# Altium project Demo_v1.PrjPcb
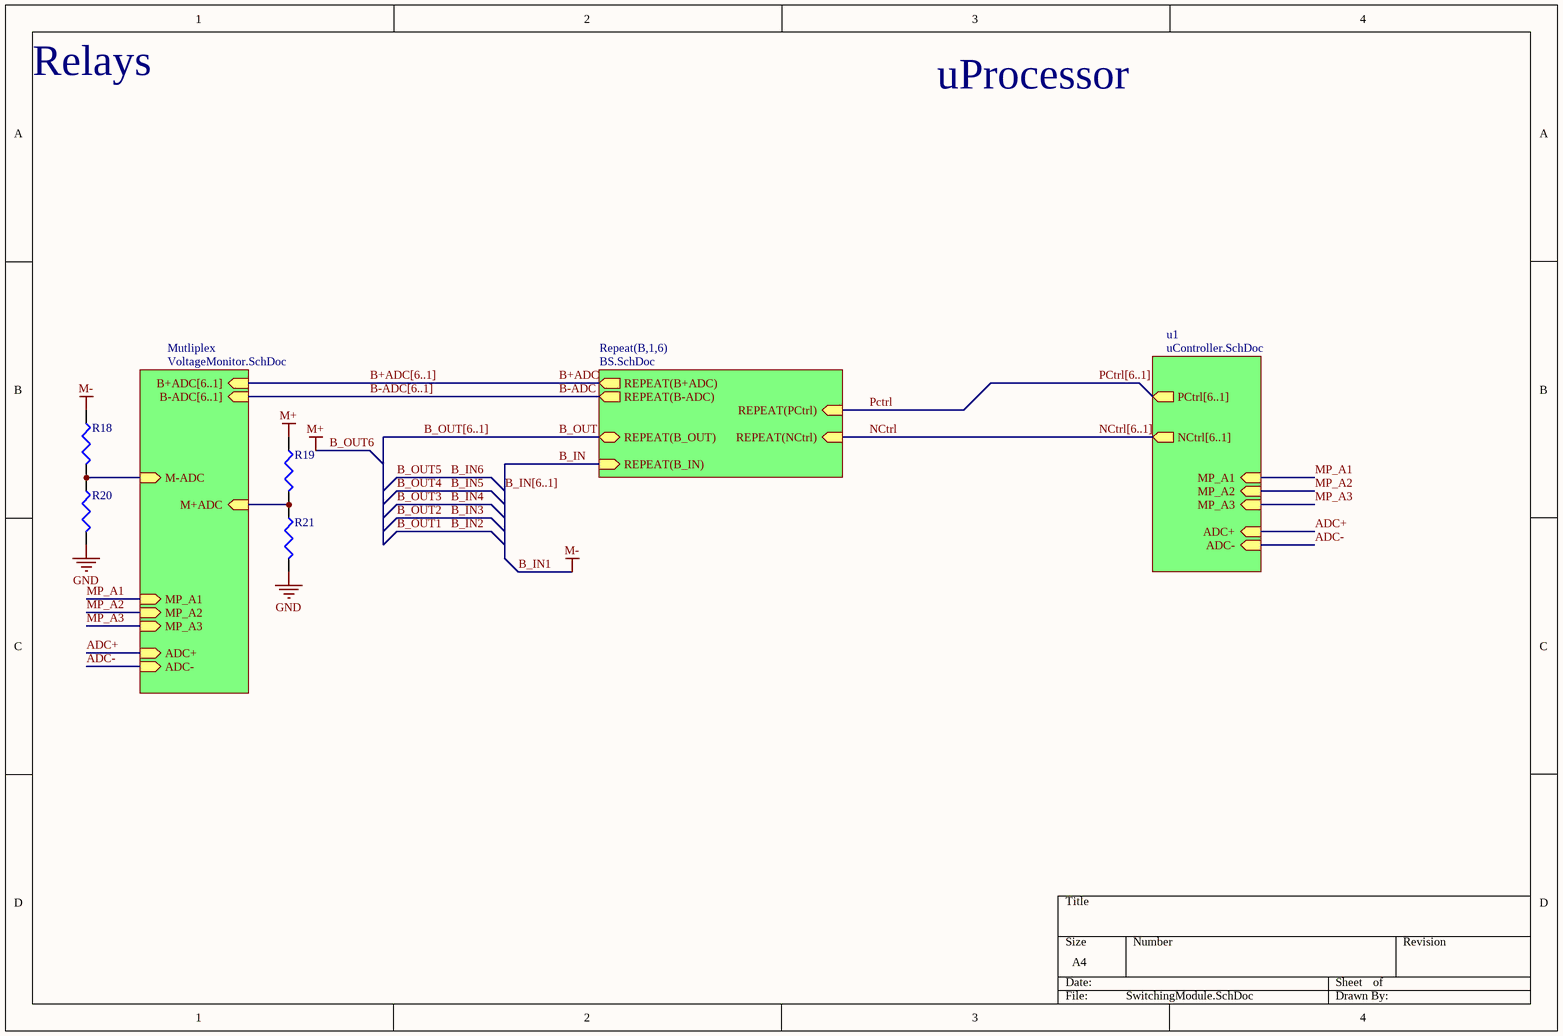
[diagram p0: SwitchingModule.SchDoc]
4 sheets, 188 parts. Net scope: hierarchical (ports join the sheet entries above them; power ports are global).
Board file: Demo_v1_2.PcbDoc
Sheets:
  SwitchingModule.SchDoc
    Mutliplex = VoltageMonitor.SchDoc
    u1 = uController.SchDoc
    B1 = BS.SchDoc
    B2 = BS.SchDoc
    B3 = BS.SchDoc
    B4 = BS.SchDoc
    B5 = BS.SchDoc
    B6 = BS.SchDoc

## Sheet SwitchingModule.SchDoc
size A4

### Parts
R18  Res3  [J1-0603]  (value not drawn)
R19  Res3  [J1-0603]  (value not drawn)
R20  Res3  [J1-0603]  (value not drawn)
R21  Res3  [J1-0603]  (value not drawn)

### Sub-sheets
Mutliplex = VoltageMonitor.SchDoc: MP_A1 (in), MP_A2 (in), MP_A3 (in), ADC+ (in), ADC- (in), B+ADC[6..1] (in), B-ADC[6..1] (in), M+ADC (in), M-ADC (in)
Repeat(B,1,6) = BS.SchDoc: REPEAT(PCtrl) (in), REPEAT(NCtrl) (in), REPEAT(B+ADC) (out), REPEAT(B_IN) (in), REPEAT(B_OUT) (bidir), REPEAT(B-ADC) (out)
u1 = uController.SchDoc: PCtrl[6..1] (out), NCtrl[6..1] (out), MP_A1 (in), MP_A2 (in), MP_A3 (in), ADC+ (in), ADC- (in)

### Nets
B_IN1: R18.1  [also labelled M-]  [project net B-]
B_OUT6: R19.1  [also labelled M+]  [project net B_OUT]
GND: R20.1 R21.1
ADC+: sheet Mutliplex/ADC+, sheet u1/ADC+
ADC-: sheet Mutliplex/ADC-, sheet u1/ADC-
B+ADC: sheet Repeat(B,1,6)/REPEAT(B+ADC)
B-ADC: sheet Repeat(B,1,6)/REPEAT(B-ADC)
B_IN: sheet Repeat(B,1,6)/REPEAT(B_IN)
B_OUT: sheet Repeat(B,1,6)/REPEAT(B_OUT)
MP_A1: sheet Mutliplex/MP_A1, sheet u1/MP_A1
MP_A2: sheet Mutliplex/MP_A2, sheet u1/MP_A2
MP_A3: sheet Mutliplex/MP_A3, sheet u1/MP_A3
NCtrl: sheet Repeat(B,1,6)/REPEAT(NCtrl)
Pctrl: sheet Repeat(B,1,6)/REPEAT(PCtrl)
NetMP1_x0: R19.2 R21.2 ; sheet Mutliplex/M+ADC
NetMP1_y0: R18.2 R20.2 ; sheet Mutliplex/M-ADC

### Buses and harness runs
bus B+ADC[6..1] = sheet Mutliplex/B+ADC[6..1]
bus B-ADC[6..1] = sheet Mutliplex/B-ADC[6..1]
bus B_IN[6..1]
bus B_OUT[6..1]
bus NCtrl[6..1] = sheet u1/NCtrl[6..1]
bus PCtrl[6..1] = sheet u1/PCtrl[6..1]

### Notes on the sheet
- Relays
- uProcessor

### Library data of the parts
R18 R19 = Res3: Resistor; Value: 100K; Published: 8-Jun-2000; LatestRevisionDate: 29-May-2009; LatestRevisionNote: IPC-7351 Footprint Added.; PackageReference: J1-0603; Publisher: Altium Limited; PackageDescription: Chip Resistor
R20 R21 = Res3: Resistor; Value: 1K; Published: 8-Jun-2000; LatestRevisionDate: 29-May-2009; LatestRevisionNote: IPC-7351 Footprint Added.; PackageReference: J1-0603; Publisher: Altium Limited; PackageDescription: Chip Resistor

## Sheet VoltageMonitor.SchDoc
size A4
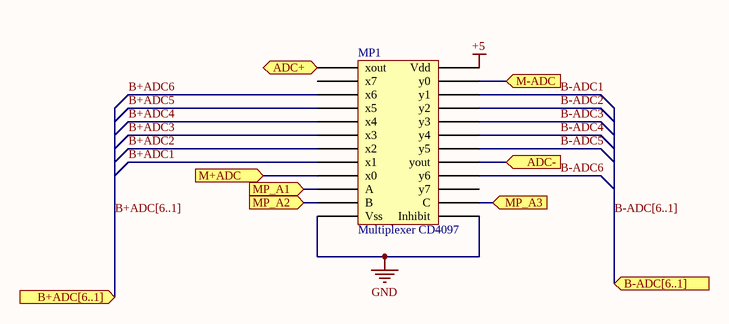
[diagram p1: VoltageMonitor.SchDoc]

### Parts
MP1  Multiplexer CD4097  [SOIC24]

### Ports
ADC+ (in), ADC- (in), B+ADC[6..1] (in), B-ADC[6..1] (in), M+ADC (in), M-ADC (in), MP_A1 (in), MP_A2 (in), MP_A3 (in)

### Nets
+5: MP1.Vdd
GND: MP1.Inhibit MP1.Vss
ADC+: MP1.xout ; port ADC+
ADC-: MP1.yout ; port ADC-
B+ADC1: MP1.x1
B+ADC2: MP1.x2
B+ADC3: MP1.x3
B+ADC4: MP1.x4
B+ADC5: MP1.x5
B+ADC6: MP1.x6
B-ADC1: MP1.y1
B-ADC2: MP1.y2
B-ADC3: MP1.y3
B-ADC4: MP1.y4
B-ADC5: MP1.y5
B-ADC6: MP1.y6
MP_A1: MP1.A ; port MP_A1
MP_A2: MP1.B ; port MP_A2
MP_A3: MP1.C ; port MP_A3
NetMP1_x0: MP1.x0 ; port M+ADC
NetMP1_y0: MP1.y0 ; port M-ADC

Not connected (* = marked no-connect by the designer): MP1 x7 y7

### Buses and harness runs
bus B+ADC[6..1] = port B+ADC[6..1]
bus B-ADC[6..1] = port B-ADC[6..1]

### Library data of the parts
MP1 = Multiplexer CD4097: pin to pad: A>10 B>11 C>14 Inhibit>13 Vdd>24 Vss>12 x0>9 x1>8 x2>7 x3>6 x4>5 x5>4 x6>3 x7>2 xout>1 y0>23 y1>22 y2>21 y3>20 y4>19 y5>18 y6>16 y7>15 yout>17

## Sheet uController.SchDoc
size A4
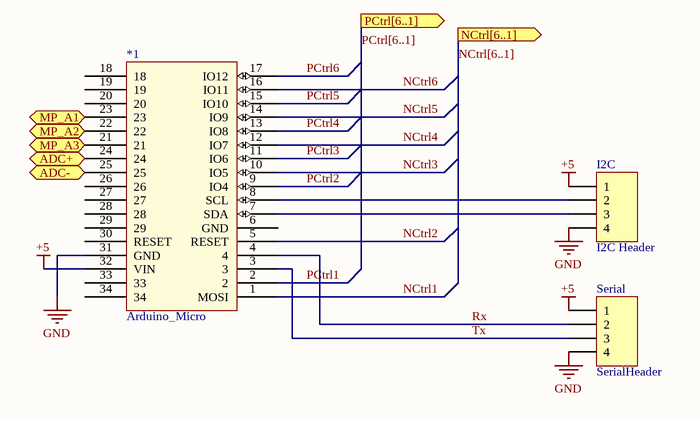
[diagram p2: uController.SchDoc]

### Parts
*1  Arduino_Micro  [DIP34]
I2C  I2C Header  [HDR1X4]
Serial  SerialHeader  [HDR1X4]

### Ports
ADC+ (in), ADC- (in), MP_A1 (out), MP_A2 (out), MP_A3 (out), NCtrl[6..1] (out), PCtrl[6..1] (out)

### Nets
+5: *1.32(VIN) I2C.1 Serial.1
GND: *1.31(GND) I2C.4 Serial.4
ADC+: *1.24 ; port ADC+
ADC-: *1.25 ; port ADC-
MP_A1: *1.23 ; port MP_A1
MP_A2: *1.22 ; port MP_A2
MP_A3: *1.21 ; port MP_A3
NCtrl1: *1.1(MOSI)
NCtrl2: *1.5(RESET)
NCtrl3: *1.10(IO5)
NCtrl4: *1.12(IO7)
NCtrl5: *1.14(IO9)
NCtrl6: *1.16(IO11)
PCtrl1: *1.2
PCtrl2: *1.9(IO4)
PCtrl3: *1.11(IO6)
PCtrl4: *1.13(IO8)
PCtrl5: *1.15(IO10)
PCtrl6: *1.17(IO12)
Rx: *1.4 Serial.2
Tx: *1.3 Serial.3
Net*1_7: *1.7(SDA) I2C.3
Net*1_8: *1.8(SCL) I2C.2

Not connected (* = marked no-connect by the designer): *1 6(GND) 18 19 20 26 27 28 29 30(RESET) 33 34

### Buses and harness runs
bus NCtrl[6..1] = port NCtrl[6..1]
bus PCtrl[6..1] = port PCtrl[6..1]

### Library data of the parts
I2C Serial = Header 4: Header, 4-Pin; LatestRevisionDate: 17-Jul-2002; LatestRevisionNote: Re-released for DXP Platform.; Publisher: Altium Limited

## Sheet BS.SchDoc
size A4
Used 6 times, as channels B1, B2, B3, B4, B5, B6. Parts and nets are listed once, with the designators drawn on the sheet.
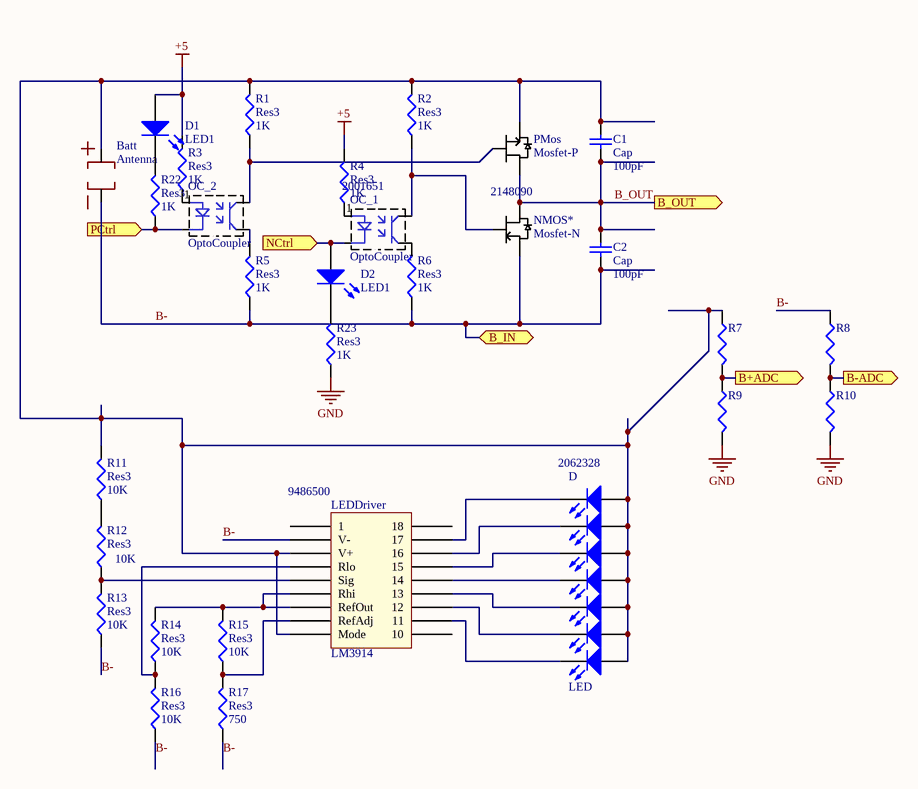
[diagram p3: BS.SchDoc]

### Parts
Batt  Antenna  [18650_PCB_HOLDER]
C1  Cap  value 100pF  [6-0805_L]
C2  Cap  value 100pF  [6-0805_L]
D  LED  Supplier Part Number 1: 2062328  [LED Strip]
D1  LED1  [LED]
D2  LED1  [LED]
LEDDriver  LM3914  Supplier Part Number 1: 9486500  [DIP18]
NMOS*  Mosfet-N  Supplier Part Number 1: 2148090  [MOSFET]
OC_1  OptoCoupler  Supplier Part Number 1: 2001651  [SMDIP4]
OC_2  OptoCoupler  [SMDIP4]
PMos  Mosfet-P  [MOSFET]
R1  Res3  value 1K  [J1-0603]
R2  Res3  value 1K  [J1-0603]
R3  Res3  value 1K  [J1-0603]
R4  Res3  value 1K  [J1-0603]
R5  Res3  value 1K  [J1-0603]
R6  Res3  value 1K  [J1-0603]
R7  Res3  [J1-0603]  (value not drawn)
R8  Res3  [J1-0603]  (value not drawn)
R9  Res3  [J1-0603]  (value not drawn)
R10  Res3  [J1-0603]  (value not drawn)
R11  Res3  value 10K  [J1-0603]
R12  Res3  value 10K  [J1-0603]
R13  Res3  value 10K  [J1-0603]
R14  Res3  value 10K  [J1-0603]
R15  Res3  value 10K  [J1-0603]
R16  Res3  value 10K  [J1-0603]
R17  Res3  value 750  [J1-0603]
R22  Res3  value 1K  [J1-0603]
R23  Res3  value 1K  [J1-0603]

### Ports
B+ADC (out), B-ADC (out), B_IN (bidir), B_OUT (out), NCtrl (in), PCtrl (in)

### Nets
+5: D1.1(A) R3.2 R4.2
GND: R9.1 R10.1 R23.1
B+ADC: R7.2 R9.2 ; port B+ADC
B-: Batt.N C2.1 LEDDriver.2(V-) NMOS*.3(Source) R5.1 R6.1 R8.1 R13.1 R16.1 R17.1 ; port B_IN
B-ADC: R8.2 R10.2 ; port B-ADC
B_OUT: C1.1 C2.2 NMOS*.2(Drain) PMos.3 ; port B_OUT
NCtrl: D2.1(A) OC_1.2 ; port NCtrl
PCtrl: OC_2.2 R22.1 ; port PCtrl
NetBatt_P: Batt.P C1.2 D.1(A) D.3(A) D.5(A) D.7(A) D.9(A) D.11(A) D.13(A) LEDDriver.3(V+) LEDDriver.9(Mode) PMos.2 R1.2 R2.2 R7.1 R11.2
NetD1_2: D1.2(K) R22.2
NetD2_2: D2.2(K) R23.2
NetD_2: D.2(K) LEDDriver.11
NetD_4: D.4(K) LEDDriver.12
NetD_6: D.6(K) LEDDriver.13
NetD_8: D.8(K) LEDDriver.14
NetD_10: D.10(K) LEDDriver.15
NetD_12: D.12(K) LEDDriver.16
NetD_14: D.14(K) LEDDriver.17
NetLEDDriver_4: LEDDriver.4(Rlo) R14.1 R16.2
NetLEDDriver_5: LEDDriver.5(Sig) R12.1 R13.2
NetLEDDriver_6: LEDDriver.6(Rhi) LEDDriver.7(RefOut) R14.2 R15.2
NetLEDDriver_8: LEDDriver.8(RefAdj) R15.1 R17.2
NetNMOS*_1: NMOS*.1(Gate) OC_1.4 R2.1
NetOC_1_1: OC_1.1 R4.1
NetOC_1_3: OC_1.3 R6.2
NetOC_2_1: OC_2.1 R3.1
NetOC_2_3: OC_2.3 R5.2
NetOC_2_4: OC_2.4 PMos.1 R1.1
NetR11_1: R11.1 R12.2

Not connected (* = marked no-connect by the designer): LEDDriver 1 10 18

### Channels
B1: designators end in .B1; ports B+ADC=B+ADC1 B-ADC=B-ADC1 B_IN=B- B_OUT=B- NCtrl=NCtrl1 PCtrl=PCtrl1
B2: designators end in .B2; ports B+ADC=B+ADC2 B-ADC=B-ADC2 B_IN=B- B_OUT=B- NCtrl=NCtrl2 PCtrl=PCtrl2
B3: designators end in .B3; ports B+ADC=B+ADC3 B-ADC=B-ADC3 B_IN=B- B_OUT=B- NCtrl=NCtrl3 PCtrl=PCtrl3
B4: designators end in .B4; ports B+ADC=B+ADC4 B-ADC=B-ADC4 B_IN=B- B_OUT=B- NCtrl=NCtrl4 PCtrl=PCtrl4
B5: designators end in .B5; ports B+ADC=B+ADC5 B-ADC=B-ADC5 B_IN=B- B_OUT=B- NCtrl=NCtrl5 PCtrl=PCtrl5
B6: designators end in .B6; ports B+ADC=B+ADC6 B-ADC=B-ADC6 B_IN=B- B_OUT=B_OUT NCtrl=NCtrl6 PCtrl=PCtrl6

### Library data of the parts
Batt = BATTERYHOLDER
C1 C2 = Cap: Capacitor; Published: 8-Jun-2000; LatestRevisionDate: 17-Jul-2002; LatestRevisionNote: Re-released for DXP Platform.; PackageReference: RAD-0.3; Publisher: Altium Limited; PackageDescription: Radial Cap, Thru-Hole; 2 Leads; 0.3 in Pin Spacing
D = LEDStrip: Supplier 1: Farnell
D1 D2 = LED1: Typical RED GaAs LED; Published: 8-Jun-2000; LatestRevisionDate: 08-Jul-2005; LatestRevisionNote: Mech Layer 1 removed.; PackageReference: LED-1; Publisher: Altium Limited; PackageDescription: LED; 2 Leads
NMOS* = Mosfet-N: pin to pad: 1>4 2>5 3>1; Supplier 1: Farnell
PMos = Mosfet-P: pin to pad: 1>4 2>1 3>5
R1-R6 R11-R17 R22 R23 = Res3: Resistor; Published: 8-Jun-2000; LatestRevisionDate: 29-May-2009; LatestRevisionNote: IPC-7351 Footprint Added.; PackageReference: J1-0603; Publisher: Altium Limited; PackageDescription: Chip Resistor
R7 R8 = Res3: Resistor; Value: 100K; Published: 8-Jun-2000; LatestRevisionDate: 29-May-2009; LatestRevisionNote: IPC-7351 Footprint Added.; PackageReference: J1-0603; Publisher: Altium Limited; PackageDescription: Chip Resistor
R9 R10 = Res3: Resistor; Value: 1K; Published: 8-Jun-2000; LatestRevisionDate: 29-May-2009; LatestRevisionNote: IPC-7351 Footprint Added.; PackageReference: J1-0603; Publisher: Altium Limited; PackageDescription: Chip Resistor
LEDDriver = LM3914: Supplier 1: Farnell
OC_1 OC_2 = OptoCoupler
  OC_1: Supplier 1: Farnell

## Nets that join several sheets
+5: VoltageMonitor (MP1.Vdd), uController (*1.32 I2C.1 Serial.1), B1 (D1.B1.1 R3.B1.2 R4.B1.2), B2 (D1.B2.1 R3.B2.2 R4.B2.2), B3 (D1.B3.1 R3.B3.2 R4.B3.2), B4 (D1.B4.1 R3.B4.2 R4.B4.2), B5 (D1.B5.1 R3.B5.2 R4.B5.2), B6 (D1.B6.1 R3.B6.2 R4.B6.2)
B-: SwitchingModule (R18.1), B1 (10 pins)
B_OUT: SwitchingModule (R19.1), B6 (C1.B6.1 C2.B6.2 NMOS*.B6.2 PMos.B6.3)
GND: SwitchingModule (R20.1 R21.1), VoltageMonitor (MP1.Inhibit MP1.Vss), uController (*1.31 I2C.4 Serial.4), B1 (R9.B1.1 R10.B1.1 R23.B1.1), B2 (R9.B2.1 R10.B2.1 R23.B2.1), B3 (R9.B3.1 R10.B3.1 R23.B3.1), B4 (R9.B4.1 R10.B4.1 R23.B4.1), B5 (R9.B5.1 R10.B5.1 R23.B5.1), B6 (R9.B6.1 R10.B6.1 R23.B6.1)
ADC+: VoltageMonitor (MP1.xout), uController (*1.24)
ADC-: VoltageMonitor (MP1.yout), uController (*1.25)
B+ADC1: VoltageMonitor (MP1.x1), B1 (R7.B1.2 R9.B1.2)
B+ADC2: VoltageMonitor (MP1.x2), B2 (R7.B2.2 R9.B2.2)
B+ADC3: VoltageMonitor (MP1.x3), B3 (R7.B3.2 R9.B3.2)
B+ADC4: VoltageMonitor (MP1.x4), B4 (R7.B4.2 R9.B4.2)
B+ADC5: VoltageMonitor (MP1.x5), B5 (R7.B5.2 R9.B5.2)
B+ADC6: VoltageMonitor (MP1.x6), B6 (R7.B6.2 R9.B6.2)
B-: B1 (C1.B1.1 C2.B1.2 NMOS*.B1.2 PMos.B1.3), B2 (10 pins)
B-: B2 (C1.B2.1 C2.B2.2 NMOS*.B2.2 PMos.B2.3), B3 (10 pins)
B-: B3 (C1.B3.1 C2.B3.2 NMOS*.B3.2 PMos.B3.3), B4 (10 pins)
B-: B4 (C1.B4.1 C2.B4.2 NMOS*.B4.2 PMos.B4.3), B5 (10 pins)
B-: B5 (C1.B5.1 C2.B5.2 NMOS*.B5.2 PMos.B5.3), B6 (10 pins)
B-ADC1: VoltageMonitor (MP1.y1), B1 (R8.B1.2 R10.B1.2)
B-ADC2: VoltageMonitor (MP1.y2), B2 (R8.B2.2 R10.B2.2)
B-ADC3: VoltageMonitor (MP1.y3), B3 (R8.B3.2 R10.B3.2)
B-ADC4: VoltageMonitor (MP1.y4), B4 (R8.B4.2 R10.B4.2)
B-ADC5: VoltageMonitor (MP1.y5), B5 (R8.B5.2 R10.B5.2)
B-ADC6: VoltageMonitor (MP1.y6), B6 (R8.B6.2 R10.B6.2)
MP_A1: VoltageMonitor (MP1.A), uController (*1.23)
MP_A2: VoltageMonitor (MP1.B), uController (*1.22)
MP_A3: VoltageMonitor (MP1.C), uController (*1.21)
NCtrl1: uController (*1.1), B1 (D2.B1.1 OC_1.B1.2)
NCtrl2: uController (*1.5), B2 (D2.B2.1 OC_1.B2.2)
NCtrl3: uController (*1.10), B3 (D2.B3.1 OC_1.B3.2)
NCtrl4: uController (*1.12), B4 (D2.B4.1 OC_1.B4.2)
NCtrl5: uController (*1.14), B5 (D2.B5.1 OC_1.B5.2)
NCtrl6: uController (*1.16), B6 (D2.B6.1 OC_1.B6.2)
NetMP1_x0: SwitchingModule (R19.2 R21.2), VoltageMonitor (MP1.x0)
NetMP1_y0: SwitchingModule (R18.2 R20.2), VoltageMonitor (MP1.y0)
PCtrl1: uController (*1.2), B1 (OC_2.B1.2 R22.B1.1)
PCtrl2: uController (*1.9), B2 (OC_2.B2.2 R22.B2.1)
PCtrl3: uController (*1.11), B3 (OC_2.B3.2 R22.B3.1)
PCtrl4: uController (*1.13), B4 (OC_2.B4.2 R22.B4.1)
PCtrl5: uController (*1.15), B5 (OC_2.B5.2 R22.B5.1)
PCtrl6: uController (*1.17), B6 (OC_2.B6.2 R22.B6.1)